# Altium schematic sheet Level Shifters.SchDoc
size A3 portrait; PageSetup: Record=PageOptions|CenterHorizontal=True|CenterVertical=True|PrintScale=1.00|XCorrection=1.00|YCorrection=1.00|PrintKind=1|BorderSize=5000000|LeftOffset=0|BottomOffset=0|Orientation=1|PaperLength=1000|PaperWidth=1000|Scale=100|PaperSource=7|PrintQuality=-4|MediaType=1|DitherType=10|PaperKind=A4|PrintScaleMode=1
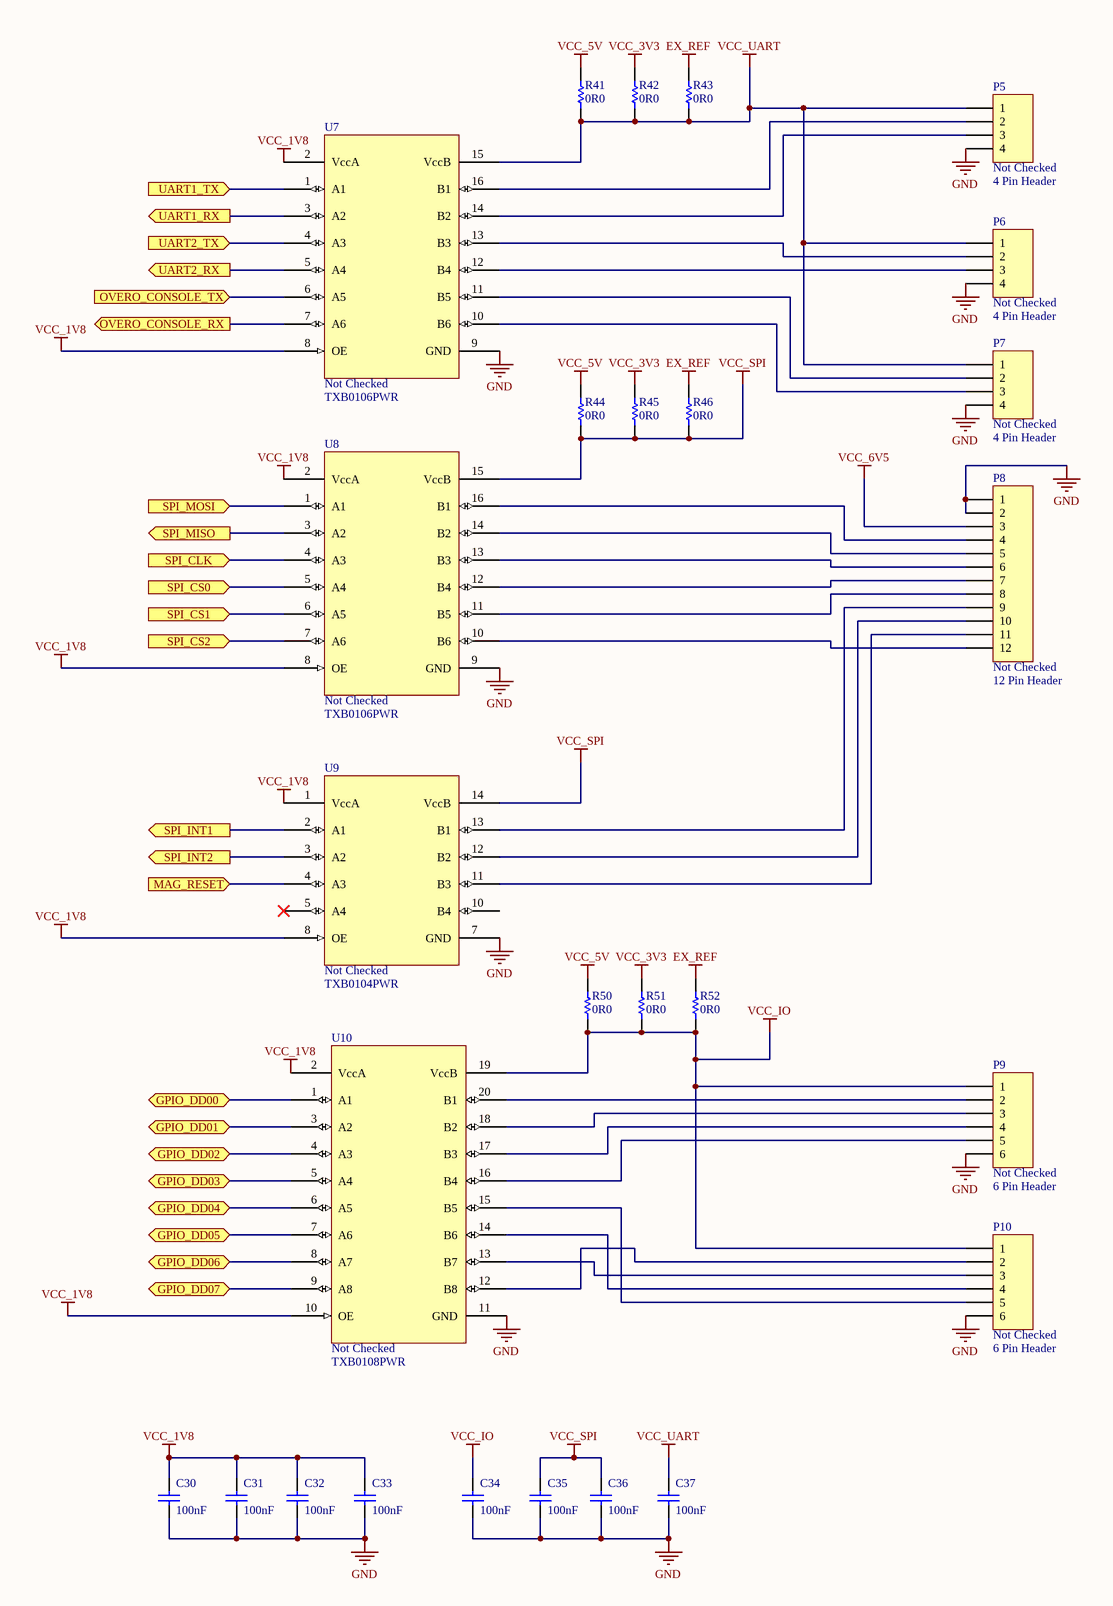
[diagram p0: Level Shifters.SchDoc]

## Parts
C30  100nF  [0603]
C31  100nF  [0603]
C32  100nF  [0603]
C33  100nF  [0603]
C34  100nF  [0603]
C35  100nF  [0603]
C36  100nF  [0603]
C37  100nF  [0603]
P5  Verify: Not Checked  [CONN_4X1_SMT_RA_1.25MM]  (hidden comment: 4 Pin Header)
P6  Verify: Not Checked  [CONN_4X1_SMT_RA_1.25MM]  (hidden comment: 4 Pin Header)
P7  Verify: Not Checked  [CONN_4X1_SMT_RA_1.25MM]  (hidden comment: 4 Pin Header)
P8  Verify: Not Checked  [CONN_12X1_SMT_RA_1.25MM]  (hidden comment: 12 Pin Header)
P9  Verify: Not Checked  [CONN_6X1_SMT_RA_1.25MM]  (hidden comment: 6 Pin Header)
P10  Verify: Not Checked  [CONN_6X1_SMT_RA_1.25MM]  (hidden comment: 6 Pin Header)
R41  0R0  [0603]  (no BOM)
R42  0R0  [0603]  (no BOM)
R43  0R0  [0603]  (no BOM)
R44  0R0  [0603]  (no BOM)
R45  0R0  [0603]  (no BOM)
R46  0R0  [0603]  (no BOM)
R50  0R0  [0603]  (no BOM)
R51  0R0  [0603]  (no BOM)
R52  0R0  [0603]  (no BOM)
U7  value TXB0106PWR  Verify: Not Checked  [TSSOP-16_PW]  (hidden comment: IC_TXB0106PWR)
U8  value TXB0106PWR  Verify: Not Checked  [TSSOP-16_PW]  (hidden comment: IC_TXB0106PWR)
U9  value TXB0104PWR  Verify: Not Checked  [TSSOP-14_PW]  (hidden comment: IC_TXB0104PWR)
U10  value TXB0108PWR  Verify: Not Checked  [TSSOP-20_PW]  (hidden comment: IC_TXB0108PWR)

## Ports
GPIO_DD00 (bidir), GPIO_DD01 (bidir), GPIO_DD02 (bidir), GPIO_DD03 (bidir), GPIO_DD04 (bidir), GPIO_DD05 (bidir), GPIO_DD06 (bidir), GPIO_DD07 (bidir), MAG_RESET (in), OVERO_CONSOLE_RX (out), OVERO_CONSOLE_TX (in), SPI_CLK (in), SPI_CS0 (in), SPI_CS1 (in), SPI_CS2 (in), SPI_INT1 (out), SPI_INT2 (out), SPI_MISO (out), SPI_MOSI (in), UART1_RX (out), UART1_TX (in), UART2_RX (out), UART2_TX (in)

## Nets
EX_REF: R43.1 R46.1 R52.1
GND: C30.1 C31.1 C32.1 C33.1 C34.1 C35.1 C36.1 C37.1 P5.4 P6.4 P7.4 P8.1 P8.2 P9.6 P10.6 U7.9(GND) U8.9(GND) U9.7(GND) U10.11(GND)
VCC_1V8: C30.2 C31.2 C32.2 C33.2 U7.2(VccA) U7.8(OE) U8.2(VccA) U8.8(OE) U9.1(VccA) U9.8(OE) U10.2(VccA) U10.10(OE)
VCC_3V3: R42.1 R45.1 R51.1
VCC_5V: R41.1 R44.1 R50.1
VCC_6V5: P8.3
VCC_IO: C34.2 P9.1 P10.1 R50.2 R51.2 R52.2 U10.19(VccB)
VCC_SPI: C35.2 C36.2 R44.2 R45.2 R46.2 U8.15(VccB) U9.14(VccB)
VCC_UART: C37.2 P5.1 P6.1 P7.1 R41.2 R42.2 R43.2 U7.15(VccB)
GPIO_DD00: U10.1(A1) ; port GPIO_DD00
GPIO_DD01: U10.3(A2) ; port GPIO_DD01
GPIO_DD02: U10.4(A3) ; port GPIO_DD02
GPIO_DD03: U10.5(A4) ; port GPIO_DD03
GPIO_DD04: U10.6(A5) ; port GPIO_DD04
GPIO_DD05: U10.7(A6) ; port GPIO_DD05
GPIO_DD06: U10.8(A7) ; port GPIO_DD06
GPIO_DD07: U10.9(A8) ; port GPIO_DD07
MAG_RESET: U9.4(A3) ; port MAG_RESET
OVERO_CONSOLE_RX: U7.7(A6) ; port OVERO_CONSOLE_RX
OVERO_CONSOLE_TX: U7.6(A5) ; port OVERO_CONSOLE_TX
SPI_CLK: U8.4(A3) ; port SPI_CLK
SPI_CS0: U8.5(A4) ; port SPI_CS0
SPI_CS1: U8.6(A5) ; port SPI_CS1
SPI_CS2: U8.7(A6) ; port SPI_CS2
SPI_INT1: U9.2(A1) ; port SPI_INT1
SPI_INT2: U9.3(A2) ; port SPI_INT2
SPI_MISO: U8.3(A2) ; port SPI_MISO
SPI_MOSI: U8.1(A1) ; port SPI_MOSI
UART1_RX: U7.3(A2) ; port UART1_RX
UART1_TX: U7.1(A1) ; port UART1_TX
UART2_RX: U7.5(A4) ; port UART2_RX
UART2_TX: U7.4(A3) ; port UART2_TX
NetP5_2: P5.2 U7.16(B1)
NetP5_3: P5.3 U7.14(B2)
NetP6_2: P6.2 U7.13(B3)
NetP6_3: P6.3 U7.12(B4)
NetP7_2: P7.2 U7.11(B5)
NetP7_3: P7.3 U7.10(B6)
NetP8_4: P8.4 U8.16(B1)
NetP8_5: P8.5 U8.14(B2)
NetP8_6: P8.6 U8.13(B3)
NetP8_7: P8.7 U8.12(B4)
NetP8_8: P8.8 U8.11(B5)
NetP8_9: P8.9 U9.13(B1)
NetP8_10: P8.10 U9.12(B2)
NetP8_11: P8.11 U9.11(B3)
NetP8_12: P8.12 U8.10(B6)
NetP9_2: P9.2 U10.20(B1)
NetP9_3: P9.3 U10.18(B2)
NetP9_4: P9.4 U10.17(B3)
NetP9_5: P9.5 U10.16(B4)
NetP10_2: P10.2 U10.12(B8)
NetP10_3: P10.3 U10.13(B7)
NetP10_4: P10.4 U10.14(B6)
NetP10_5: P10.5 U10.15(B5)

Not connected (* = marked no-connect by the designer): U9 5(A4)* 10(B4)

## Library data of the parts
C30-C37 = CP_100nF 0603: CAP CER .10UF 50V X5R 0603; Manufacturer: Taiyo Yuden; Manufacturer PN: UMK107B7104KA-T; Prototype: Digikey 587-1243-1-ND; LatestRevisionDate: 29 May 08; Value: 100nF
P5-P7 = JP_4PIN HDR_SMT_RA_MOLEX: CONN HDR VERT 4POS .100" SNGL; Manufacturer: Molex; Manufacturer PN: 53261-0471; Prototype: Digikey WM7622CT-ND; LatestRevisionDate: 24 Jun 08; Value: 4 Pin Header
P8 = JP_12PIN HDR_SMT_RA_MOLEX: CONN HDR VERT 12POS .100" SNGL; Manufacturer: Molex; Manufacturer PN: 53261-1271; Prototype: Digikey WM7630CT-ND; LatestRevisionDate: 24 Jun 08; Value: 12 Pin Header
P9 P10 = JP_6PIN HDR_SMT_RA_MOLEX: CONN HDR VERT 6POS .100" SNGL; Manufacturer: Molex; Manufacturer PN: 53261-0671; Prototype: Digikey WM7624CT-ND; LatestRevisionDate: 24 Jun 08; Value: 6 Pin Header
R41-R46 R50-R52 = RS_0R0 0603: RES 0.0 OHM 1/10W 5% 0603 SMD; Manufacturer: Rohm; Manufacturer PN: MCR03EZPJ000; Prototype: DigiKey RHM0.0GCT-ND; LatestRevisionDate: 3 Jun 08; Value: 0R0
U7 U8 = IC_TXB0106PWR: IC VOLT-LEVEL TRANSLATOR 16TSSOP; Manufacturer: Texas Instruments; Prototype: Digikey 296-23759-1-ND; LastRevisionDate: n/a; Manufacturer PN: TXB0106PWR
U9 = IC_TXB0104PWR: IC VOLT-LEVEL TRANSLATOR 14TSSOP; Manufacturer: Texas Instruments; Prototype: Digikey 296-21929-1-ND; LastRevisionDate: n/a; Manufacturer PN: TXB0104PWR
U10 = IC_TXB0108PWR: IC VOLT-LEVEL TRANSLATOR 20TSSOP; Manufacturer: Texas Instruments; Prototype: Digikey 296-21527-1-ND; LastRevisionDate: n/a; Manufacturer PN: TXB0108PWR